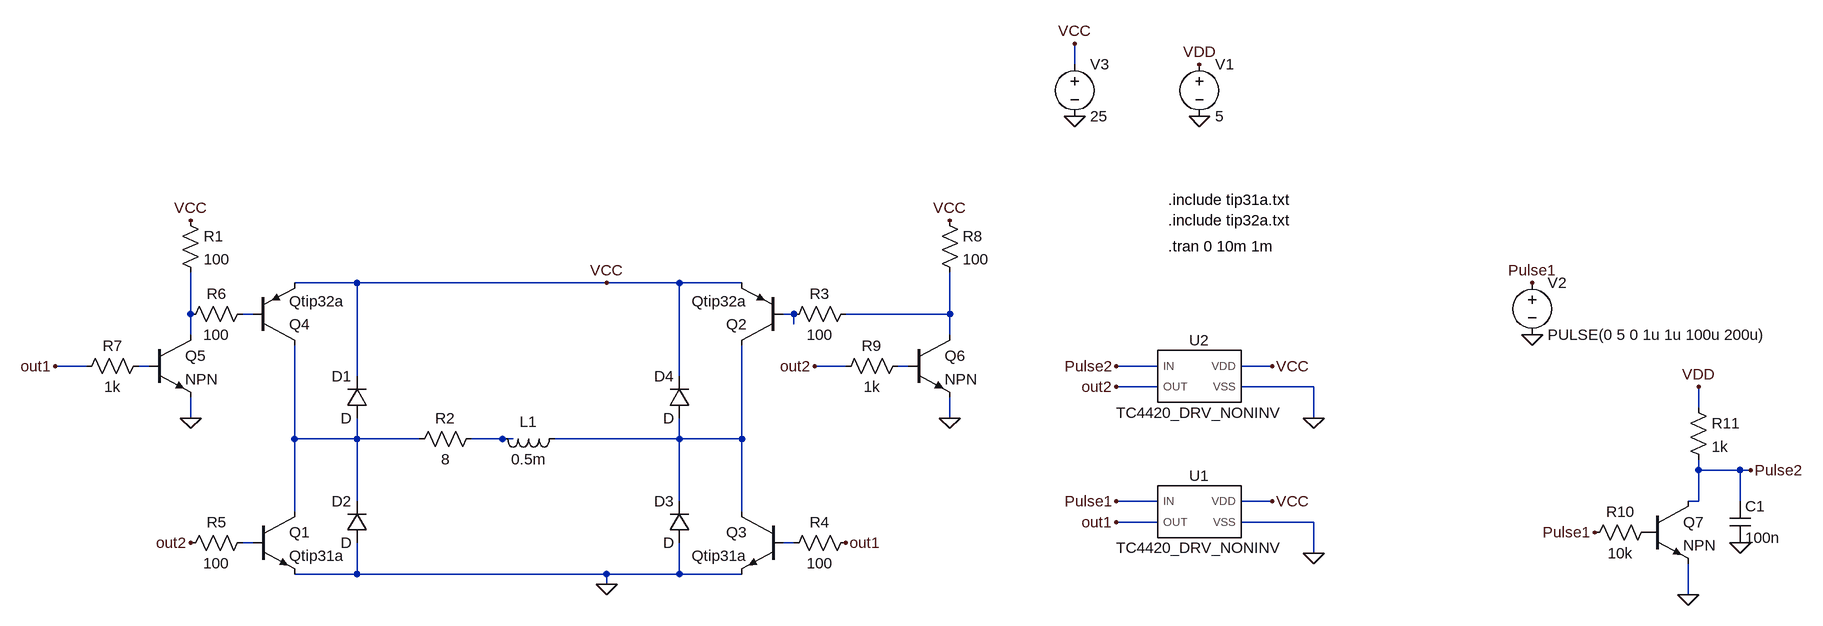
[diagram p0: schematic main.asc]
main.asc, the LTspice schematic file:
Version 4.1
SHEET 1 1276 1128
WIRE 144 -96 144 -128
WIRE -960 240 -1056 240
WIRE -576 240 -960 240
WIRE -464 240 -576 240
WIRE -368 240 -464 240
WIRE -1216 288 -1216 224
WIRE -1120 288 -1136 288
WIRE -288 288 -304 288
WIRE -48 288 -48 224
WIRE -48 288 -208 288
WIRE -288 304 -288 288
WIRE -1216 320 -1216 288
WIRE -48 320 -48 288
WIRE -1376 368 -1424 368
WIRE -1280 368 -1296 368
WIRE -208 368 -256 368
WIRE -112 368 -128 368
WIRE 272 368 208 368
WIRE 448 368 400 368
WIRE -960 384 -960 240
WIRE -464 384 -464 240
WIRE 272 400 208 400
WIRE 512 400 400 400
WIRE 1104 432 1104 400
WIRE -1216 448 -1216 416
WIRE -48 448 -48 416
WIRE 512 448 512 400
WIRE -1056 480 -1056 336
WIRE -960 480 -960 448
WIRE -960 480 -1056 480
WIRE -864 480 -960 480
WIRE -736 480 -784 480
WIRE -720 480 -736 480
WIRE -464 480 -464 448
WIRE -464 480 -656 480
WIRE -368 480 -368 336
WIRE -368 480 -464 480
WIRE 1104 528 1104 512
WIRE 1168 528 1104 528
WIRE 1184 528 1168 528
WIRE -960 576 -960 480
WIRE -464 576 -464 480
WIRE 272 576 208 576
WIRE 448 576 400 576
WIRE 1104 576 1104 528
WIRE 1104 576 1088 576
WIRE 1168 576 1168 528
WIRE -1056 592 -1056 480
WIRE -368 592 -368 480
WIRE 272 608 208 608
WIRE 512 608 400 608
WIRE -1120 640 -1136 640
WIRE -288 640 -304 640
WIRE 512 656 512 608
WIRE -960 688 -960 640
WIRE -960 688 -1056 688
WIRE -576 688 -960 688
WIRE -464 688 -464 640
WIRE -464 688 -576 688
WIRE -368 688 -464 688
WIRE -576 704 -576 688
WIRE 1088 720 1088 672
FLAG 512 656 0
FLAG 848 320 0
FLAG -576 704 0
FLAG 144 -16 0
FLAG 144 -128 VCC
FLAG -576 240 VCC
FLAG 448 576 VCC
FLAG 848 240 Pulse1
FLAG 208 576 Pulse1
FLAG 1184 528 Pulse2
FLAG 512 448 0
FLAG 448 368 VCC
FLAG 208 368 Pulse2
FLAG -1216 448 0
FLAG -1216 144 VCC
FLAG -48 448 0
FLAG -48 144 VCC
FLAG 208 608 out1
FLAG 208 400 out2
FLAG -208 640 out1
FLAG -1424 368 out1
FLAG -256 368 out2
FLAG -1216 640 out2
FLAG 1088 720 0
FLAG 944 624 Pulse1
FLAG 336 -16 0
FLAG 336 -96 VDD
FLAG 1104 400 VDD
FLAG 1168 640 0
SYMBOL npn -1120 592 R0
SYMATTR InstName Q1
SYMATTR Value Qtip31a
SYMBOL pnp -304 336 R180
SYMATTR InstName Q2
SYMATTR Value Qtip32a
SYMBOL TC4420_DRV_NONINV 336 592 R0
SYMATTR InstName U1
SYMBOL voltage 848 224 R0
WINDOW 123 0 0 Left 0
WINDOW 39 0 0 Left 0
SYMATTR InstName V2
SYMATTR Value PULSE(0 5 0 1u 1u 100u 200u)
SYMBOL npn -304 592 M0
SYMATTR InstName Q3
SYMATTR Value Qtip31a
SYMBOL pnp -1120 336 M180
SYMATTR InstName Q4
SYMATTR Value Qtip32a
SYMBOL diode -944 448 R180
WINDOW 0 24 64 Left 2
WINDOW 3 24 0 Left 2
SYMATTR InstName D1
SYMBOL diode -944 640 R180
WINDOW 0 24 64 Left 2
WINDOW 3 24 0 Left 2
SYMATTR InstName D2
SYMBOL diode -448 640 R180
WINDOW 0 24 64 Left 2
WINDOW 3 24 0 Left 2
SYMATTR InstName D3
SYMBOL diode -448 448 R180
WINDOW 0 24 64 Left 2
WINDOW 3 24 0 Left 2
SYMATTR InstName D4
SYMBOL res -192 272 R90
WINDOW 0 0 56 VBottom 2
WINDOW 3 32 56 VTop 2
SYMATTR InstName R3
SYMATTR Value 100
SYMBOL res -192 624 R90
WINDOW 0 0 56 VBottom 2
WINDOW 3 32 56 VTop 2
SYMATTR InstName R4
SYMATTR Value 100
SYMBOL res -1120 624 R90
WINDOW 0 0 56 VBottom 2
WINDOW 3 32 56 VTop 2
SYMATTR InstName R5
SYMATTR Value 100
SYMBOL res -1120 272 R90
WINDOW 0 0 56 VBottom 2
WINDOW 3 32 56 VTop 2
SYMATTR InstName R6
SYMATTR Value 100
SYMBOL voltage 144 -112 R0
WINDOW 123 0 0 Left 0
WINDOW 39 0 0 Left 0
SYMATTR InstName V3
SYMATTR Value 25
SYMBOL TC4420_DRV_NONINV 336 384 R0
SYMATTR InstName U2
SYMBOL npn -1280 320 R0
SYMATTR InstName Q5
SYMBOL res -1232 128 R0
SYMATTR InstName R1
SYMATTR Value 100
SYMBOL res -1280 352 R90
WINDOW 0 0 56 VBottom 2
WINDOW 3 32 56 VTop 2
SYMATTR InstName R7
SYMATTR Value 1k
SYMBOL npn -112 320 R0
SYMATTR InstName Q6
SYMBOL res -64 128 R0
SYMATTR InstName R8
SYMATTR Value 100
SYMBOL res -112 352 R90
WINDOW 0 0 56 VBottom 2
WINDOW 3 32 56 VTop 2
SYMATTR InstName R9
SYMATTR Value 1k
SYMBOL res -768 464 R90
WINDOW 0 0 56 VBottom 2
WINDOW 3 32 56 VTop 2
SYMATTR InstName R2
SYMATTR Value 8
SYMBOL ind -640 464 R90
WINDOW 0 5 56 VBottom 2
WINDOW 3 32 56 VTop 2
SYMATTR InstName L1
SYMATTR Value 0.5m
SYMBOL npn 1024 576 R0
SYMATTR InstName Q7
SYMBOL res 1040 608 R90
WINDOW 0 0 56 VBottom 2
WINDOW 3 32 56 VTop 2
SYMATTR InstName R10
SYMATTR Value 10k
SYMBOL res 1088 416 R0
SYMATTR InstName R11
SYMATTR Value 1k
SYMBOL voltage 336 -112 R0
WINDOW 123 0 0 Left 0
WINDOW 39 0 0 Left 0
SYMATTR InstName V1
SYMATTR Value 5
SYMBOL cap 1152 576 R0
SYMATTR InstName C1
SYMATTR Value 100n
TEXT 288 112 Left 2 !.include tip31a.txt
TEXT 288 144 Left 2 !.include tip32a.txt
TEXT 288 184 Left 2 !.tran 0 10m 1m

The netlist it stands for:
* main.asc
Q1 N007 N010 0 0 Qtip31a
Q2 N009 N003 VCC 0 Qtip32a
X§U1 Pulse1 out1 VCC 0 TC4420_DRV_NONINV  ; pins IN OUT VDD VSS
V2 Pulse1 0 PULSE(0 5 0 1u 1u 100u 200u)
Q3 N009 N011 0 0 Qtip31a
Q4 N007 N002 VCC 0 Qtip32a
D1 N007 VCC D
D2 0 N007 D
D3 0 N009 D
D4 N009 VCC D
R3 N004 N003 100
R4 out1 N011 100
R5 N010 out2 100
R6 N002 N001 100
V3 VCC 0 25
X§U2 Pulse2 out2 VCC 0 TC4420_DRV_NONINV  ; pins IN OUT VDD VSS
Q5 N001 N005 0 0 NPN
R1 VCC N001 100
R7 N005 out1 1k
Q6 N004 N006 0 0 NPN
R8 VCC N004 100
R9 N006 out2 1k
R2 N008 N007 8
L1 N009 N008 0.5m
Q7 Pulse2 P001 0 0 NPN
R10 P001 Pulse1 10k
R11 VDD Pulse2 1k
V1 VDD 0 5
C1 Pulse2 0 100n
.model D D
.lib standard.dio
.model NPN NPN
.model PNP PNP
.lib standard.bjt
.include tip31a.txt
.include tip32a.txt
.tran 0 10m 1m
.lib C:\Users\eLab.DESKTOP-0F5BO84\Desktop\surya\50wamp\tc4420.txt
.backanno
.end